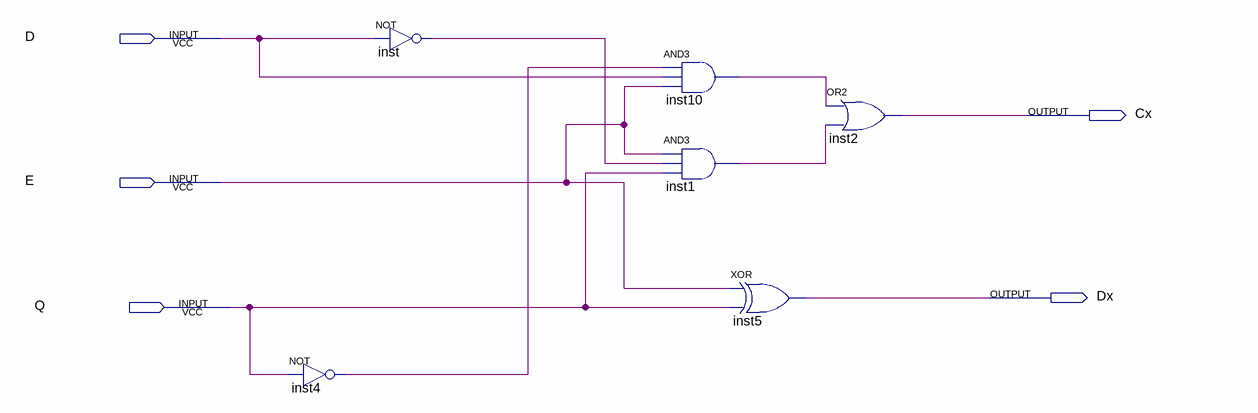
[diagram p0: schematic sheet]
// Quartus schematic HAS.bdf as structural Verilog: 6 symbols, 5 pins
module HAS (
  input  D,
  input  E,
  input  Q,
  output Cx,
  output Dx
);

  wire inst1_out, inst4_out, inst10_out, inst_out;

  not inst4 (inst4_out, Q);
  not inst (inst_out, D);
  and inst10 (inst10_out, inst4_out, D, E);
  and inst1 (inst1_out, E, inst_out, Q);
  xor inst5 (Dx, E, Q);
  or inst2 (Cx, inst10_out, inst1_out);
endmodule
